# EAGLE design esptoy_v200 (EAGLE 9.3.0)
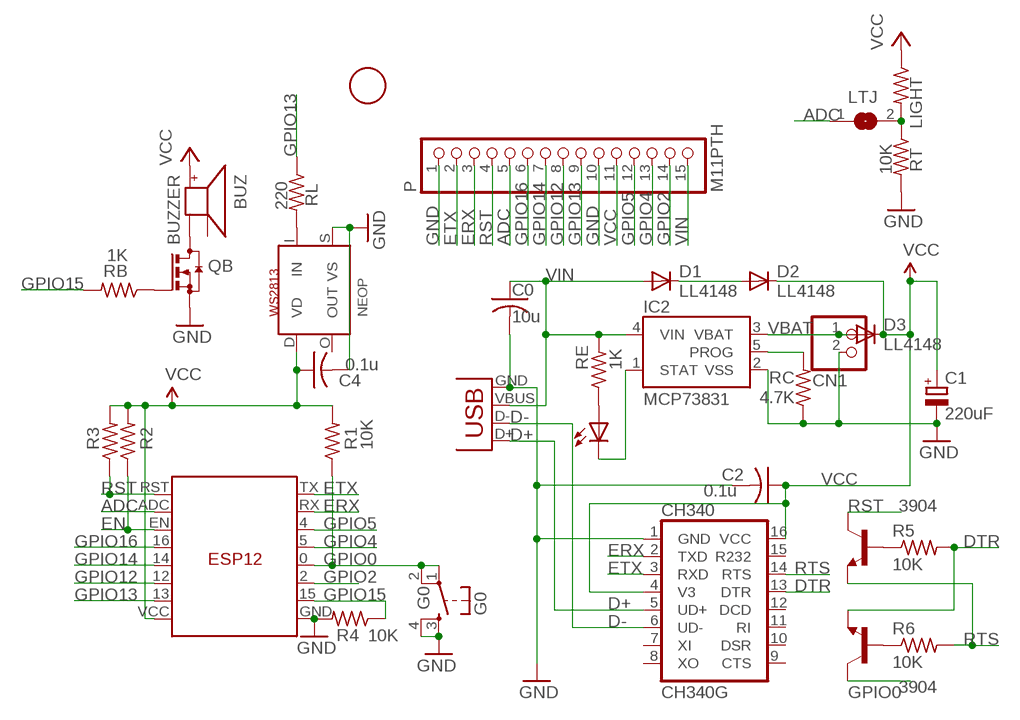
[diagram p0: schematic, sheet 1]

## Parts
1F  FIDUCIAL  [FIDUCIAL_1MM]
BUZ  BUZZER  [SMT-8585-BUZZER]
C0  10u  C-USC0805K  [C0805K]
C1  220uF  CPOL-EUCT3528  [CT3528]
C2  0.1u  C-USC0603K  [C0603K]
C4  0.1u  C-USC0603K  [C0603K]
CH340  CH340G  [SO16]
CHG  0805  LEDCHIPLED_0805  [CHIPLED_0805]
CN1  JST_2PIN-SMT-RA  [JST-PH-2-SMT-RA]
D1  LL4148  DIODE-DO-214AC  [DO-214AC]
D2  LL4148  DIODE-DO-214AC  [DO-214AC]
D3  LL4148  DIODE-DO-214AC  [DO-214AC]
G0  G0  TAC_SWITCHSMD  [TACTILE_SWITCH_SMD]
IC2  MCP73831  [SOT23-5]
LIGHT  100K  R-US_R1206  [R1206]
LTJ  SJ  [SJ]
NEOP  WS2813  [RGBLED5050_4]
P  M11PTH  PINHD-1X15-CB  [1X15-CB]
QB  AO3400  BSS123  [SOT23]
R1  10K  R-US_R0603  [R0603]
R2  10K  R-US_R0603  [R0603]
R3  10K  R-US_R0603  [R0603]
R4  10K  R-US_R0603  [R0603]
R5  10K  R-US_R0603  [R0603]
R6  10K  R-US_R0603  [R0603]
RB  1K  R-US_R0603  [R0603]
RC  4.7K  R-US_R0603  [R0603]
RE  1K  R-US_R0603  [R0603]
RL  220  R-US_R0603  [R0603]
RT  10K  R-US_R0603  [R0603]
T1  3904  MMBT3904LT1-NPN-SOT23-BEC  [SOT23-BEC]
T2  3904  MMBT3904LT1-NPN-SOT23-BEC  [SOT23-BEC]
U$1  ESP8266  ESP12  [ESP12]
X3  USBMICROB2  [USB-MICROB2]

## Nets
ADC: LTJ.1 P.5 U$1.ADC
ADC1: LIGHT.2 LTJ.2 RT.1
D+: CH340.5(UD+) X3.D+
D-: CH340.6(UD-) X3.D-
DTR: CH340.13(DTR) R5.2 T2.E
EN: R2.1 U$1.EN
ERX: CH340.2(TXD) P.3 U$1.RX
ETX: CH340.3(RXD) P.2 U$1.TX
GND: C0.2 C1.- C2.2 C4.2 CH340.1(GND) CN1.2 G0.3 G0.4 IC2.2(VSS) NEOP.S(VS) P.1 P.10 QB.2(S) R4.2 RC.1 RT.2 U$1.GND X3.GND
GPIO0: G0.1 G0.2 R1.1 T2.C U$1.0(G0)
GPIO2: P.14 U$1.2(G2)
GPIO4: P.13 U$1.5(G5)
GPIO5: P.12 U$1.4(G4)
GPIO12: P.8 U$1.12(G12)
GPIO13: P.9 RL.1 U$1.13(G13)
GPIO14: P.7 U$1.14(G14)
GPIO15: R4.1 RB.2 U$1.15(G15)
GPIO16: P.6 U$1.16(G16)
N$1: D1.C D2.A
N$2: R5.1 T1.B
N$3: IC2.5(PROG) RC.2
N$4: CHG.A RE.1
N$5: CHG.C IC2.1(STAT)
N$6: R6.1 T2.B
N$7: BUZ.- QB.3(D)
N$8: QB.1(G) RB.1
N$9: NEOP.I(IN) RL.2
RST: P.4 R3.1 T1.C U$1.RST
RTS: CH340.14(RTS) R6.2 T1.E
VBAT [power]: CN1.1 D3.A IC2.3(VBAT)
VCC [vcc]: BUZ.+ C1.+ C2.1 C4.1 CH340.4(V3) CH340.16(VCC) D2.C D3.C LIGHT.1 NEOP.D(VD) P.11 R1.2 R2.2 R3.2 U$1.VCC
VIN [vin]: C0.1 D1.A IC2.4(VIN) P.15 RE.2 X3.VBUS
Unconnected: BUZ.A- CH340.7(XI) CH340.8(XO) CH340.9(CTS) CH340.10(DSR) CH340.11(RI) CH340.12(DCD) CH340.15(R232) NEOP.O(OUT)

## Library data of the parts
1F = adafruitGood:FIDUCIAL: For use by pick and place machines to calibrate the vision/machine, 1mm By microbuilder.eu
BUZ = adafruit:BUZZER
C0 = adafruit2013:C-US: CAPACITOR, American symbol
C1 = rcl:CPOL-EU: POLARIZED CAPACITOR, European symbol
C2 C4 = adafruit:C-US: CAPACITOR, American symbol
CH340 = SparkFunNew:CH340
CHG = led:LED: LED OSRAM: - CHIPLED LG R971, LG N971, LY N971, LG Q971, LY Q971, LO R971, LY R971 LH N974, LH R974 LS Q976, LO Q976, LY Q976 LO Q996 - Hyper CHIPLED LW Q18S LB Q993, LB Q99A, LB R99A - SideLED LS A670, LO A670, LY A670, LG A670, LP A670 LB A673, LV A673, LT A673, LW A673 LH A674 LY A675 LS A676, LA A676, LO A676, LY A676, LW A676 LS A679, LY A679, LG A679 - Hyper Micro SIDELED® LS Y876, LA Y876, LO Y876, LY Y876 LT Y87S - SmartLED LW L88C, LW L88S LB L89C, LB L89S, LG L890 LS L89K, LO L89K, LY L89K LS L896, LA L896, LO L896, LY L896 - TOPLED LS T670, LO T670, LY T670, LG T670, LP T670 LSG T670, LSP T670, LSY T670, LOP T670, LYG T670 LG T671, LOG T671, LSG T671 LB T673, LV T673, LT T673, LW T673 LH T674 LS T676, LA T676, LO T676, LY T676, LB T676, LH T676, LSB T676, LW T676 LB T67C, LV T67C, LT T67C, LS T67K, LO T67K, LY T67K, LW E67C LS E67B, LA E67B, LO E67B, LY E67B, LB E67C, LV E67C, LT E67C LW T67C LS T679, LY T679, LG T679 LS T770, LO T770, LY T770, LG T770, LP T770 LB T773, LV T773, LT T773, LW T773 LH T774 LS E675, LA E675, LY E675, LS T675 LS T776, LA T776, LO T776, LY T776, LB T776 LHGB T686 LT T68C, LB T68C - Hyper Mini TOPLED® LB M676 - Mini TOPLED Santana® LG M470 LS M47K, LO M47K, LY M47K Source: http://www.osram.convergy.de LUXEON: - LUMILED® LXK2-PW12-R00, LXK2-PW12-S00, LXK2-PW14-U00, LXK2-PW14-V00 LXK2-PM12-R00, LXK2-PM12-S00, LXK2-PM14-U00 LXK2-PE12-Q00, LXK2-PE12-R00, LXK2-PE12-S00, LXK2-PE14-T00, LXK2-PE14-U00 LXK2-PB12-K00, LXK2-PB12-L00, LXK2-PB12-M00, LXK2-PB14-N00, LXK2-PB14-P00, LXK2-PB14-Q00 LXK2-PR12-L00, LXK2-PR12-M00, LXK2-PR14-Q00, LXK2-PR14-R00 LXK2-PD12-Q00, LXK2-PD12-R00, LXK2-PD12-S00 LXK2-PH12-R00, LXK2-PH12-S00 LXK2-PL12-P00, LXK2-PL12-Q00, LXK2-PL12-R00 Source: www.luxeon.com KINGBRIGHT: KA-3528ASYC Source: www.kingbright.com
CN1 = adafruit:JST_2PIN: JST 2-Pin Connectors of various flavors SMT-RA (S2B-PH-SM4) 4UConnector #17311 SMT (B2B-PH-SM4) THM-RA (S2B-PH) THM (B2B-PH)
D1-D3 = diode:DIODE-: DIODE
G0 = SparkFunNew:TAC_SWITCH: Momentary Switch Button commonly used for reset or general input. Spark Fun Electronics SKU : COM-00097
IC2 = SparkFunNew:MCP73831: Microchip's MCP73831 Miniature single cell, fully integrated Li-Ion, Li-polymer charge management controller http://ww1.microchip.com/downloads/en/DeviceDoc/21984a.pdf
LIGHT R5 R6 RC RL RT = adafruit2013:R-US_: RESISTOR, American symbol
LTJ = jumper:SJ: SMD solder JUMPER
NEOP = adafruit:WS2813
P = adafruit:PINHD-1X15: PIN HEADER
QB = transistor-small-signal:BSS123: N-CHANNEL MOS FET
R1-R4 RB RE = adafruit (picker 的冲突副本 2014-10-29):R-US_: RESISTOR, American symbol
T1 T2 = transistor-neu-to92:*-NPN-: NPN Transistror
U$1 = JeeParts:ESP12
X3 = SparkFunNew:USB: USB Connectors USB-B-PTH is fully proven SKU : PRT-00139 USB-miniB is fully proven SKU : PRT-00587 USB-A-PCB is untested. USB-A-H is throughly reviewed, but untested. Spark Fun Electronics SKU : PRT-00437 USB-B-SMT is throughly reviewed, but untested. Needs silkscreen touching up. USB-A-S has not been used/tested USB-MB-H has not been used/tested

## Net classes
0 default: width 0.178 mm
1 power: width 0.178 mm
2 vcc: width 0.254 mm
3 vin: width 0.305 mm

## Board
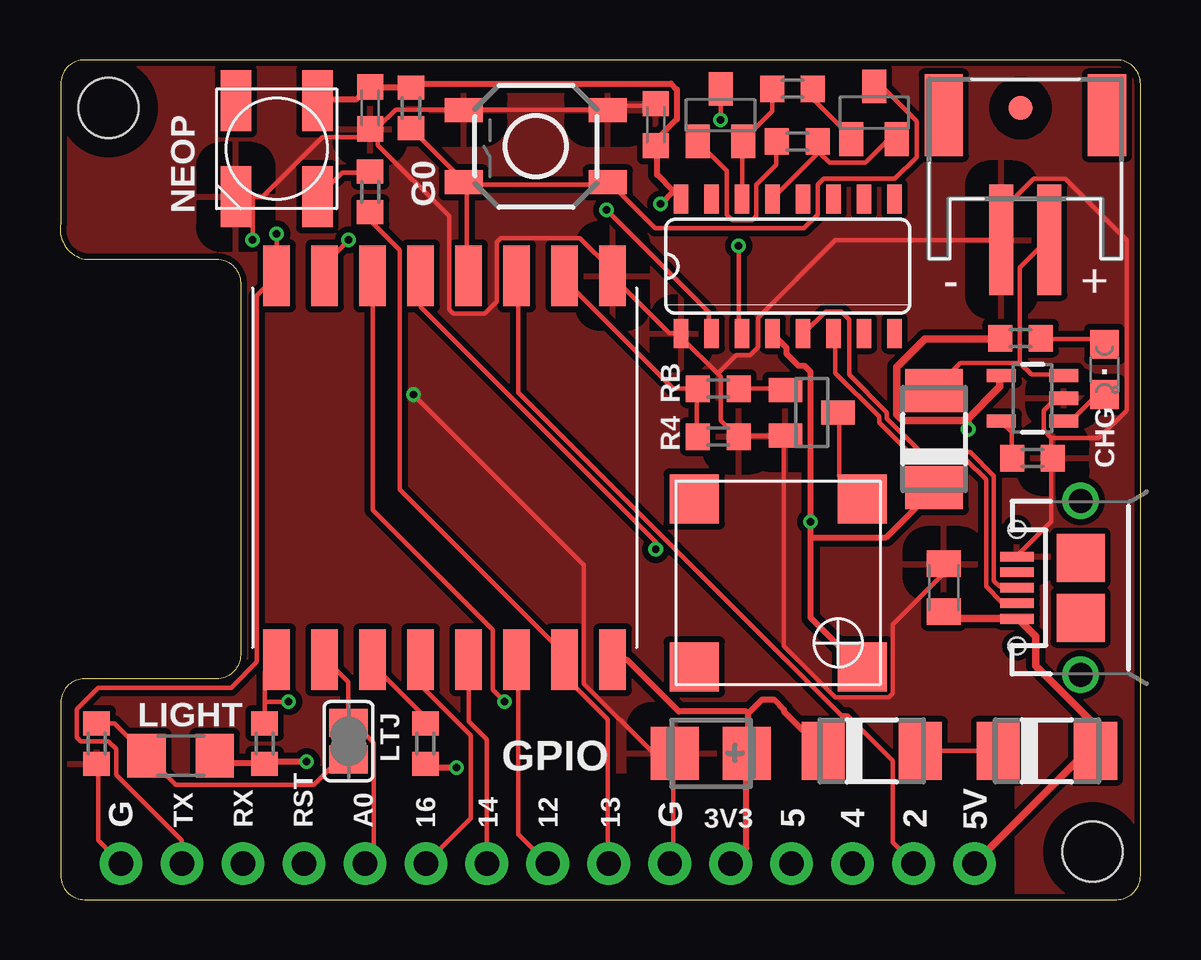
[diagram p1: board, top side]
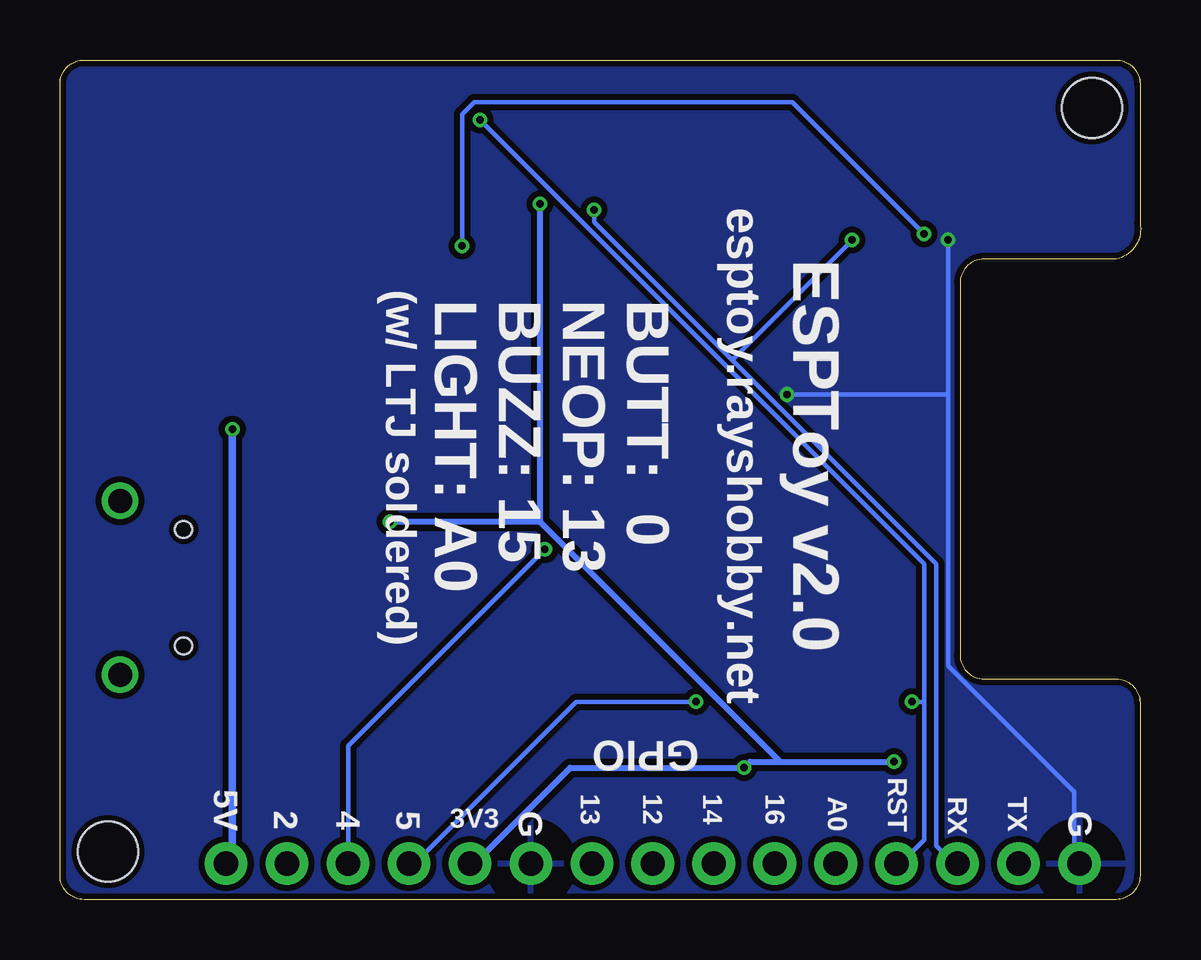
[diagram p2: board, bottom side, seen from below]

Size 45.02 x 35 mm. Coordinates in mm from the lower left corner, seen from the top.
Outline: 45.02,1 45.02,34 arc90 44.02,35 1.02,35 arc90 0.02,34 0.02,28.2 arc90 1.02,26.7 6.52,26.7 arc-90 7.52,25.7 7.52,10.2 arc-90 6.52,9.2 1.02,9.2 arc90 0.02,8.2 0.02,1 arc90 1.02,0 44.02,0 arc90 45.02,1
Copper layers (1*16): Top 0.035mm / dielectric 1.5mm / Bottom 0.035mm
Design rules "Fusion_eagle_rule_v1.1 *": minimum track width 6mil, minimum drill 12mil, track to track 6mil, track to pad 6mil, pad to pad 6mil, via to via 6mil, smd to smd 0mil, copper to edge 10mil, drill to drill 10mil, minimum pad ring 10mil, minimum via ring 6mil, stop-mask expansion 2mil, vias tented up to drill 100mil, thermal gap 40mil
Holes 2.5 mm at 2.02,33 43.02,2
tRestrict: area 0.2,31.2 to 3.8,34.8; area 41.2,0.2 to 44.8,3.8; area 0,0 to 39.5,5
vRestrict: area 2,3 to 38.6,4.6

### Footprints (pad centres in the part's own frame; a part is rotated, then mirrored left to right if it is on the bottom)
FIDUCIAL_1MM = smd 1 x 1: 1 0,0
SMT-8585-BUZZER = smd 2.05 x 2.05: + -3.5,-3.5; - 3.5,-3.5; A- 3.5,3.5; NC1 -3.5,3.5
C0805K = smd 1.1 x 1.4: 1 -1,0; 2 1,0
CT3528 = smd 2 x 2.2: + -1.5,0; - 1.5,0
C0603K = smd 1.05 x 1.08: 1 -0.875,0; 2 0.875,0
SO16 = smd 0.6 x 1.2: 1 -4.445,-2.8; 2 -3.175,-2.8; 3 -1.905,-2.8; 4 -0.635,-2.8; 5 0.635,-2.8; 6 1.905,-2.8; 7 3.175,-2.8; 8 4.445,-2.8; 9 4.445,2.8; 10 3.175,2.8; 11 1.905,2.8; 12 0.635,2.8; 13 -0.635,2.8; 14 -1.905,2.8; 15 -3.175,2.8; 16 -4.445,2.8
CHIPLED_0805 = smd 1.2 x 1.2: A 0,-1.05; C 0,1.05
JST-PH-2-SMT-RA = smd 1 x 4.6: 1 1,-3.7; 2 -1,-3.7 | smd 1.6 x 3.4: NC1 -3.4,1.5; NC2 3.4,1.5
DO-214AC = smd 1.8 x 2.4: A 2.025,0; C -2.025,0
TACTILE_SWITCH_SMD = smd 1.6 x 1: 1 -3,1.5; 2 3,1.5; 3 -3,-1.5; 4 3,-1.5
SOT23-5 = smd 0.55 x 1.2: 1 -0.95,-1.3; 2 0,-1.3; 3 0.95,-1.3; 4 0.95,1.3; 5 -0.95,1.3
R1206 = smd 1.6 x 1.803: 1 -1.422,0; 2 1.422,0
SJ = smd 1.168 x 1.6: 1 -0.762,0; 2 0.762,0
RGBLED5050_4 = smd 2.54 x 1.27: D -2,1.7; I 2,1.7; O -2,-1.7; S 2,-1.7
1X15-CB = drill 1.016 pad 1.778: 1 -17.78,0; 2 -15.24,0; 3 -12.7,0; 4 -10.16,0; 5 -7.62,0; 6 -5.08,0; 7 -2.54,0; 8 0,0; 9 2.54,0; 10 5.08,0; 11 7.62,0; 12 10.16,0; 13 12.7,0; 14 15.24,0; 15 17.78,0
SOT23 = smd 1 x 1.4: 1 -0.95,-1.1; 2 0.95,-1.1; 3 0,1.1
R0603 = smd 1 x 1.1: 1 -0.85,0; 2 0.85,0
SOT23-BEC = smd 1 x 1.4: B -0.95,-1.1; C 0,1.1; E 0.95,-1.1
ESP12 = smd 2.54 x 1.1: 0 8,-1; 2 8,-3; 4 8,3; 5 8,1; 12 -8,-3; 13 -8,-5; 14 -8,-1; 15 8,-5; 16 -8,1; ADC -8,5; EN -8,3; GND 8,-7; RST -8,7; RX 8,5; TX 8,7; VCC -8,-7
USB-MICROB2 = smd 0.4 x 1.4: D+ 0,2.65; D- -0.65,2.65; GND 1.3,2.65; ID 0.65,2.65; VBUS -1.3,2.65 | drill 1: MT1 -3.625,0; MT2 3.625,0 | smd 2 x 2: MT3 1.25,0; MT4 -1.25,0 | hole 0.7: -2.425,2.65; 2.425,2.65

### Placement (x,y rotation side)
1F  40.02,33 0 top
BUZ  29.92,13.2 90 top
C0  36.82,13 90 top
C1  27.12,6.1 180 top
C2  24.82,32.3 90 top
C4  12.92,33 270 top
CH340  30.32,26.4 0 top
CHG  43.52,22.1 180 top
CN1  40.22,31.2 0 top
D1  41.12,6.2 0 top
D2  33.82,6.2 0 top
D3  36.42,19.2 90 top
G0  19.82,31.4 180 top
IC2  40.52,20.9 90 top
LIGHT  5.02,6 180 top
LTJ  12.02,6.6 270 top
NEOP  9.02,31.3 270 top
P  20.32,1.5 0 top
QB  31.32,20.3 270 top
R1  14.62,33 90 top
R2  15.22,6.5 270 top
R3  8.52,6.5 270 top
R4  27.42,19.3 0 top
R5  30.72,31.6 0 top
R6  30.52,33.8 180 top
RB  27.42,21.3 180 top
RC  40.52,18.4 180 top
RE  40.02,23.4 180 top
RL  12.92,29.5 90 top
RT  1.52,6.5 270 top
T1  27.52,32.7 0 top
T2  33.92,32.8 0 top
U$1  16.02,18 90 top
X3  42.52,13 90 top

### Tracks (layer width: path | path; a pad name or v marks a point on that pad's centre or on a via)
ADC
  Top 0.178: U$1.ADC 11.1,9.99 12,9.08 12,7.43 LTJ.1 12.09,7.35 12.25,7.35 13.08,6.52 13.08,1.9 12.75,1.57 P.5
ADC1
  Top 0.178: RT.1 1.6,7.35 2.26,7.35 3.58,6.03 LIGHT.2 3.67,5.94 4.82,4.79 10.58,4.79 11.57,5.78 12,5.78 LTJ.2
D+
  Top 0.178: CH340.5 30.99,23.61 31.9,24.52 32.56,24.52 32.89,24.19 32.89,21.88 34.46,20.31 34.46,20.06 35.86,18.66 37.93,18.66 38.92,17.67 38.92,13.29 39.16,13.04 39.82,13.04 X3.D+
D-
  Top 0.178: CH340.6 32.31,23.53 32.31,21.96 34.13,20.14 34.13,19.89 35.7,18.33 37.76,18.33 38.59,17.5 38.59,13.04 39.25,12.38 39.82,12.38 X3.D-
DTR
  Top 0.178: CH340.13 29.67,29.22 31.57,31.12 31.57,31.53 R5.2 31.65,31.12 32.06,30.71 33.55,30.71 34.54,31.7 T2.E
EN
  Top 0.178: R2.1 15.22,7.43 15.22,7.59 13.08,9.74 13.08,9.99 U$1.EN
ERX  (via drill 0.3)
  Top 0.178: v22.77,28.75 27.02,24.5 27.02,23.75 CH340.2 | U$1.RX 11.02,26.5 v12.02,27.5
  Bottom 0.178: v22.77,28.75 22.77,28.25 17.02,22.5 | 17.02,22.5 8.52,14 8.52,2.25 7.77,1.5 P.3 | 17.02,22.5 v12.02,27.5
ETX  (via drill 0.3)
  Top 0.178: P.2 5.07,1.57 5.07,2.48 2.35,5.2 2.35,6.27 2.02,6.6 0.86,6.6 0.7,6.77 0.7,7.92 1.6,8.83 7.13,8.83 8.21,9.91 8.21,25.18 8.22,25.2 U$1.TX | 8.95,25.92 U$1.TX | v28.27,27.25 28.27,23.75 CH340.3 | U$1.TX v9.02,27.75
  Bottom 0.178: v28.27,27.25 28.27,32.75 27.77,33.25 14.52,33.25 v9.02,27.75
GND  (via drill 0.3)
  Top 0.178: 41.31,19.23 41.31,18.41 RC.1 41.31,18.33 41.31,15.77 39.91,14.36 X3.GND | 41.31,19.23 40.98,19.56 40.98,20.39 41.47,20.89 41.81,20.89 IC2.2 | 41.31,19.23 43.29,19.23 44.45,20.39 44.45,27.49 41.89,30.05 40.57,30.05 39.25,28.73 39.25,27.57 CN1.2 39.16,27.49 32.31,27.49 29.09,24.27 29.09,23.03 28.76,22.7 28.18,22.7 27.4,21.92 | P.10 25.46,1.57 25.54,1.65 25.54,6.03 C1.- 25.46,6.03 24.8,6.03 21.83,9 21.83,13.95 v14.73,21.05 | C0.2 36.77,13.95 36.77,13.54 34.71,11.47 34.71,8.59 34.54,8.42 32.31,8.42 30.17,10.57 30.17,19.23 QB.2 30.17,19.32 28.35,19.32 R4.2 28.18,19.32 27.52,19.98 27.52,21.79 27.4,21.92 | 27.4,21.92 25.96,23.36 25.96,23.53 CH340.1 25.87,23.61 25.38,23.61 23.07,25.92 U$1.GND 22.98,26 22.98,26.25 21.66,27.57 18.36,27.57 18.2,27.41 18.2,24.93 17.7,24.43 16.38,24.43 16.21,24.6 16.21,28.48 13.24,31.45 13.24,32.11 C4.2 | P.1 2.51,1.57 1.6,2.48 1.6,5.61 RT.2 1.93,5.61 | C2.2 24.8,33.1 23.07,33.1 22.9,32.94 G0.3 22.82,32.94 16.87,32.94 G0.4 16.79,32.94 13.99,32.94 13.24,32.19 13,32.19 C4.2 | 8.02,29.3 8.45,29.3 10.93,31.78 12.58,31.78 12.91,32.11 C4.2 | 8.02,29.3 7.38,29.3 NEOP.S | 8.02,29.3 v8.02,27.5
  Bottom 0.178: v8.02,27.5 8.02,21.05 | 8.02,21.05 8.02,9.75 2.77,4.5 2.77,1.5 P.1 | 8.02,21.05 v14.73,21.05
  pour Bottom (isolate 0.254): 0.02,0 0.02,35 45.02,35 45.02,0
  pour Top (isolate 0.254): 0.02,0 0.02,35 45.02,35 45.02,0
GPIO0
  Top 0.178: R1.1 14.65,32.11 16.79,29.97 G0.2 | U$1.0 16.96,26 16.96,29.8 16.87,29.88 G0.2 | T2.C 33.96,33.85 34.29,33.85 35.7,32.44 35.7,30.96 34.79,30.05 31.82,30.05 31.57,29.8 31.57,28.56 30.99,27.98 24.8,27.98 22.9,29.88 G0.1 22.74,29.88 22.65,29.8 17.04,29.8 G0.2
GPIO2
  Top 0.178: U$1.2 19.1,25.92 19.1,21.13 32.56,7.68 32.81,7.68 34.71,5.78 34.71,2.39 35.53,1.57 P.14
GPIO4  (via drill 0.3)
  Top 0.178: v24.82,14.6 24.82,14.9 15.02,24.7 U$1.5
  Bottom 0.178: P.13 33.02,6.4 v24.82,14.6
GPIO5  (via drill 0.3)
  Top 0.178: U$1.4 13.02,16.25 18.02,11.25 18.02,8.75 v18.52,8.25
  Bottom 0.178: v18.52,8.25 23.52,8.25 30.27,1.5 P.12
GPIO12
  Top 0.178: U$1.12 19.1,9.99 19.1,2.72 20.26,1.57 P.8
GPIO13
  Top 0.178: RL.1 13,28.64 13,28.23 14.15,27.08 14.15,17.09 21,10.24 21,10.07 U$1.13 21.09,9.99 21.09,9.25 22.82,7.51 22.82,1.57 P.9
GPIO14
  Top 0.178: U$1.14 17.04,9.99 17.04,7.43 17.78,6.69 17.78,1.57 P.7
GPIO15
  Top 0.178: R4.1 26.53,19.32 26.53,21.3 RB.2 26.45,21.3 25.54,21.3 21.09,25.76 21.09,25.92 U$1.15
GPIO16
  Top 0.178: U$1.16 15.06,9.99 15.06,8.91 17.12,6.85 17.12,3.38 15.31,1.57 P.6
N$1
  Top 0.178: D1.C 39.08,6.19 35.86,6.19 D2.A
N$2
  Top 0.178: R5.1 29.84,31.53 29.84,30.63 29.01,29.8 29.01,28.48 28.84,28.32 28.02,28.32 27.77,28.56 27.77,30.38 26.62,31.53 T1.B
N$3
  Top 0.178: RC.2 39.66,18.41 39.66,19.48 39.25,19.89 IC2.5
N$4
  Top 0.178: RE.1 40.9,23.36 43.29,23.36 43.46,23.2 CHG.A
N$5
  Top 0.178: CHG.C 43.46,20.97 43.13,20.97 42.14,19.98 41.89,19.98 IC2.1
N$6
  Top 0.178: R6.1 31.4,33.76 31.4,33.35 32.97,31.78 T2.B
N$7
  Top 0.178: QB.3 32.48,20.23 32.48,17.67 33.38,16.76 BUZ.-
N$8
  Top 0.178: RB.1 28.35,21.3 30.17,21.3 QB.1
N$9
  Top 0.178: RL.2 12.91,30.3 11.76,30.3 10.77,29.3 NEOP.I
RST  (via drill 0.3)
  Top 0.178: 8.52,8.25 8.52,9.5 U$1.RST | 8.52,8.25 R3.1 | v27.52,32.5 T1.C | v9.52,8.25 8.52,8.25
  Bottom 0.178: v27.52,32.5 9.02,14 9.02,8.25 | 9.02,8.25 9.02,2.5 10.02,1.5 P.4 | 9.02,8.25 v9.52,8.25
RTS
  Top 0.178: R6.2 29.67,33.76 29.67,32.85 28.43,31.62 T1.E 28.43,31.53 28.43,29.22 CH340.14
VBAT
  Top 0.178: 39.99,22.37 40.48,21.88 41.81,21.88 IC2.3 | 39.99,22.37 37.51,22.37 36.44,21.3 D3.A | 39.99,22.37 39.99,26.33 41.14,27.49 CN1.1
VCC  (via drill 0.3)
  Top 0.254: LIGHT.1 6.47,5.94 6.72,5.7 8.45,5.7 R3.2 8.52,5.75 v10.27,5.75 | P.11 28.02,1.57 28.6,2.15 28.6,6.03 C1.+ 28.68,6.19 28.68,7.76 | 28.68,7.76 29.26,8.34 29.75,8.34 30.17,7.92 30.17,7.84 31.73,6.27 D2.C | U$1.VCC 23.07,9.99 23.64,9.99 25.79,7.84 28.6,7.84 28.68,7.76 | NEOP.D 10.77,33.35 12.33,33.35 12.83,33.85 C4.1 13,33.85 14.56,33.85 R1.2 14.73,33.85 14.89,34.01 25.46,34.01 25.71,33.76 25.71,32.52 24.88,31.7 24.88,31.53 C2.1 24.88,31.37 24.88,30.21 25.56,29.54 | 25.56,29.54 25.87,29.22 CH340.16 | 31.27,15.1 31.27,11.75 33.27,9.75 BUZ.+ | 31.27,15.1 v31.27,15.75 31.27,22 31.02,22.25 30.77,22.25 30.27,22.75 30.27,23 29.77,23.5 CH340.4 | v16.52,5.5 15.27,5.5 R2.2 | v25.02,29 25.56,29.54 | 31.27,15.1 34.42,15.1 36.42,17.1 D3.C
  Bottom 0.254: P.11 27.77,1.5 23.77,5.5 v16.52,5.5 16.27,5.75 15.02,5.75 | 15.02,5.75 v10.27,5.75 | 25.02,15.75 v31.27,15.75 | 15.02,5.75 25.02,15.75 | 25.02,15.75 v25.02,29
VIN  (via drill 0.3)
  Top 0.305: C0.1 36.85,11.97 37.1,11.72 39.82,11.72 X3.VBUS 39.99,11.64 40.65,10.98 40.65,9.74 43.13,7.26 43.13,6.27 D1.A 43.04,6.11 42.71,6.11 38.17,1.57 P.15 | 37.76,19.98 35.12,19.98 34.87,20.23 34.87,22.21 36.03,23.36 39.16,23.36 RE.2 | 37.76,19.98 39.16,21.38 39.16,21.79 IC2.4 | v37.84,19.6 37.84,19.89 37.76,19.98
  Bottom 0.305: v37.84,19.6 37.84,1.82 38.09,1.57 P.15

### Text on the board
tPlace: CHG | GPIO | G | TX | RX | RST | A0 | 16 | 14 | 12 | 13 | G | 3V3 | 5 | 4 | 2 | 5V
bPlace: GPIO | RST | 5V | G | TX | RX | A0 | 16 | 14 | 12 | 13 | G | 5 | 4 | 2 | 3V3
bNames: BUTT: 0 / NEOP: 13 / BUZZ: 15 / LIGHT: A0 | ESPToy v2.0 | esptoy.rayshobby.net | (w/ LTJ soldered)